# EasyEDA schematic HeaterFlowRegulator_2021-05-24.json
TITLE: Sheet_1; REV: 1.0; Date: 2020-05-02; Sheet: 1/1; Drawn By: Thomas_2213; Company: Your Company
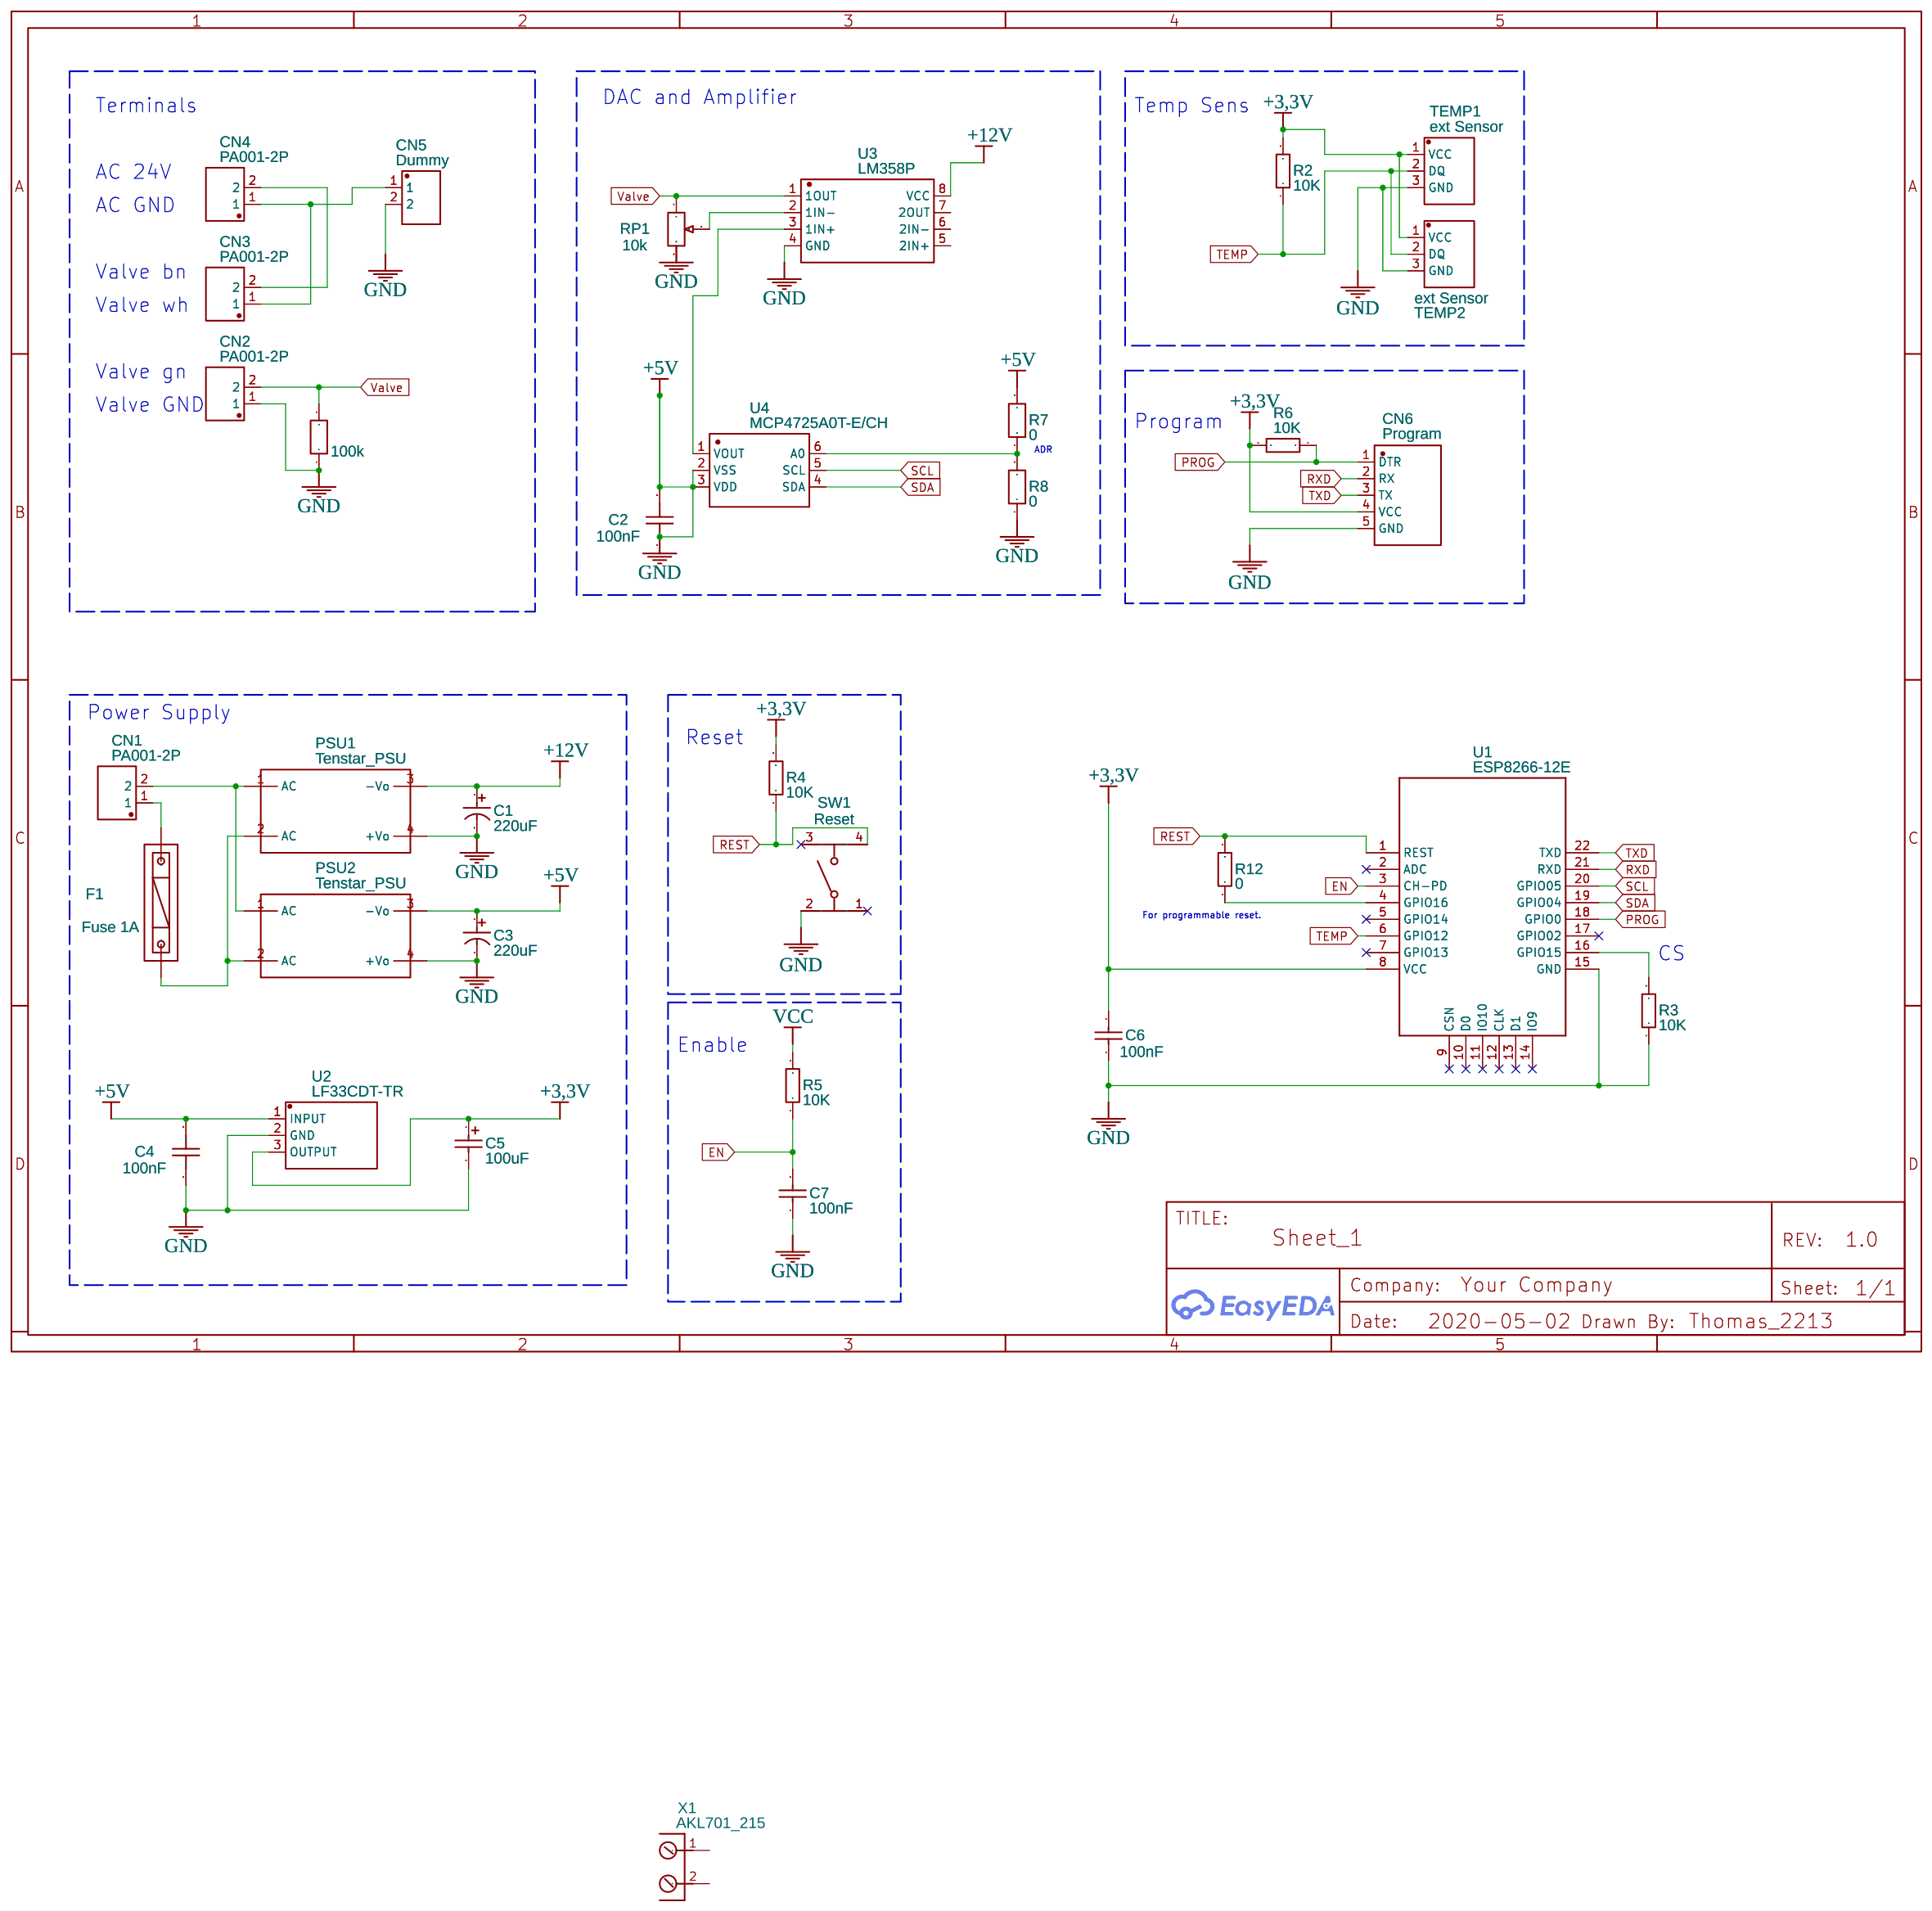
[diagram p0: schematic sheet]

## Parts
C1  220uF  [CAP-TH_BD8.0-P3.50-D1.0-FD]
C2  100nF  [C0603]
C3  220uF  [CAP-TH_BD8.0-P3.50-D1.0-FD]
C4  100nF  [C0603]
C5  100uF  [CAP-SMD_L3.5-W2.8]
C6  100nF  [0603]
C7  100nF  [0603]
CN1  PA001-2P  [CONN-TH_2P-P5.08_PA001-2P]
CN2  PA001-2P  [CONN-TH_2P-P5.08_PA001-2P]
CN3  PA001-2P  [CONN-TH_2P-P5.08_PA001-2P]
CN4  PA001-2P  [CONN-TH_2P-P5.08_PA001-2P]
CN5  Dummy  [CONN-TH_2P-P5.08_PA001-2P]
CN6  Program  [CONN-TH_B5B-XH-AM (LF)(SN)]
F1  Fuse 1A  [FUSE-TH_L22.6-W9.0]
PSU1  Tenstar_PSU  [AC-DC PSU 5V/3W]
PSU2  Tenstar_PSU  [AC-DC PSU 5V/3W]
R1  100k  [R0201]
R2  10K  [0603]
R3  10K  [0603]
R4  10K  [0603]
R5  10K  [0603]
R6  10K  [0603]
R7  0  [R0603]
R8  0  [R0603]
R12  0  [R0603]
RP1  10k  [RES-ADJ-TH_3386P]
SW1  Reset  [KEY-SMD_4P-L6.0-W6.0-P4.50-LS10.0]
TEMP1  ext Sensor  [CONN-TH_3P-P2.50_B3B-XH-AM(LF)(SN)]
TEMP2  ext Sensor  [CONN-TH_3P-P2.50_B3B-XH-AM(LF)(SN)]
U1  ESP8266-12E  [LGA22-2.0-24X16MM]
U2  LF33CDT-TR  [TO-252-2_L6.6-W6.1-P4.57-LS9.9-BR-CW]
U3  LM358P  [DIP-8_L9.4-W6.4-P2.54-LS9.1-BL]
U4  MCP4725A0T-E/CH  [SOT-23-6_L2.9-W1.6-P0.95-LS2.8-BR]
X1  AKL701_215  [AKL701_2_15]

## Library data of the parts
C1 C3 = 220uf/35V: Supplier: LCSC; Manufacturer: ValuePro; Supplier Part: C2063
C2 C4 = CL10B104KC8NNNC: Supplier: LCSC; Manufacturer: SAMSUNG; Supplier Part: C15725; LCSC Assembly: Yes; SMT Type: Extend
C5 = TAJB107K006RNJ: Supplier: LCSC; Manufacturer: AVX; Supplier Part: C16133; JLCPCB Part Class: Basic Part
C6 = CL10B104JB8NNNC: Supplier: LCSC; Manufacturer Part: CL10B104KC8NNNC; Manufacturer: SAMSUNG; Supplier Part: C15725; LCSC Assembly: Yes; SMT Type: Extend
C7 = CL10B104JB8NNNC: Supplier: LCSC; Manufacturer: SAMSUNG; Supplier Part: C24452; LCSC Assembly: Yes; SMT Type: Extend
CN1-CN5 = PA001-2P: Supplier: LCSC; Manufacturer: HIWA; Contributor: LCSC; Supplier Part: C128027; LCSC Assembly: Yes; SMT Type: Extend
CN6 = B5B-XH-AM (LF)(SN): Supplier: LCSC; Supplier Part: C161872; Manufacturer: JST Sales America; Contributor: LCSC
F1 = Fuse transparent seat: Supplier: LCSC; Manufacturer: ReliaPro; image: //image.lceda.cn/szlcsc/C58066.jpg; Supplier Part: C58066; LCSC Assembly: Yes; SMT Type: Extend
PSU1 PSU2 = Tenstar_PSU: Manufacturer Part: Tenstar Robot; Contributor: Steve Shaw; Supplier Part: TSP-05; Supplier: Tenstar Robot
R1 = R_0201_EU: Contributor: LCEDA_Lib; Package Display: No
R2 R3 = TC0310B1002T5E: Supplier: LCSC; Supplier Part: C39050; Manufacturer: UniOhm; Manufacturer Part: TC0325B1002T5E; Contributor: LCSC; LCSC Assembly: Yes; SMT Type: Extend
R4-R6 = TC0310B1002T5E: Supplier: LCSC; Supplier Part: C190321; Manufacturer: Uniroyal Elec; Contributor: LCSC; LCSC Assembly: Yes; SMT Type: Extend
R7 R8 = R_0603_EU: Contributor: LCEDA_Lib
R12 = 0603WAJ0000T5E: Supplier: LCSC; Manufacturer: UniOhm; Supplier Part: C15402
RP1 = R_3386P_EU: Supplier: LCSC; Contributor: LCEDA_Lib; Value(Ω): 10K
SW1 = TL3301TF160QG/D310794: Supplier: LCSC; Supplier Part: C273532; Manufacturer: E-Switch; Contributor: LCSC
TEMP1 TEMP2 = B3B-XH-AM-(LF)(SN): Supplier: LCSC; Supplier Part: C161870; Manufacturer: JST Sales America; Contributor: LCSC
U1 = -: SMD ESP8266 based WiFi module FCC/CE; Supplier Part: 317060015; Supplier: SeeedStudio; Manufacturer Part: ESP8266-12E/ESP-12E; sourceId: x7jTsOM8S
U2 = LF33CDT-TR: Supplier: LCSC; Supplier Part: C222179; Manufacturer: STMicroelectronics; Contributor: LCSC; JLCPCB Part Class: Extended Part
U3 = LM358P: Supplier: LCSC; Manufacturer: TI; image: //image.lceda.cn/szlcsc/C5213.jpg; Supplier Part: C5213
U4 = MCP4725A0T-E/CH: Supplier: LCSC; Manufacturer: MICROCHIP; Contributor: LCSC; Supplier Part: C144198; LCSC Assembly: Yes; SMT Type: Extend
X1 = AKL701_215

## Nets
+5V: C1.2 C2.1 C2.2 C3.1 C3.2 C4.1 C4.2 C5.2 C6.1 C7.1 CN2.1 CN5.2 CN6.5(GND) PSU1.4(+Vo) PSU2.3(-Vo) PSU2.4(+Vo) R1.1 R3.1 R7.2 R8.1 RP1.3 SW1.2 TEMP1.3(GND) TEMP2.3(GND) U1.15(GND) U2.1(INPUT) U2.2(GND) U3.4(GND) U4.2(VSS) U4.3(VDD)
+12V: C1.1 PSU1.3(-Vo) U3.8(VCC)
VCC: R5.2
+3,3V: C5.1 C6.2 CN6.4(VCC) R2.2 R4.2 R6.2 TEMP1.1(VCC) TEMP2.1(VCC) U1.8(VCC) U2.3(OUTPUT)
EN: C7.2 R5.1 U1.3(CH-PD)
PROG: CN6.1(DTR) R6.1 U1.18(GPIO0)
REST: R4.1 R12.2 SW1.4 U1.1(REST)
RXD: CN6.2(RX) U1.21(RXD)
SCL: U1.20(GPIO05) U4.5(SCL)
SDA: U1.19(GPIO04) U4.4(SDA)
TEMP: R2.1 TEMP1.2(DQ) TEMP2.2(DQ) U1.6(GPIO12)
TXD: CN6.3(TX) U1.22(TXD)
Valve: CN2.2 R1.2 RP1.1 U3.1(1OUT)
Net-(CN1-1): CN1.1 F1.2
Net-(CN1-2): CN1.2 PSU1.1(AC) PSU2.1(AC)
Net-(CN3-1): CN3.1 CN4.1 CN5.1
Net-(CN3-2): CN3.2 CN4.2
Net-(F1-1): F1.1 PSU1.2(AC) PSU2.2(AC)
Net-(R3-2): R3.2 U1.16(GPIO15)
Net-(R7-1): R7.1 R8.2 U4.6(A0)
Net-(R12-1): R12.1 U1.4(GPIO16)
Net-(RP1-2): RP1.2 U3.2(1IN-)
Net-(U3-3): U3.3(1IN+) U4.1(VOUT)

Not connected (* = marked no-connect by the designer): SW1 1* 3*; U1 2(ADC)* 5(GPIO14)* 7(GPIO13)* 9(CSN)* 10(D0)* 11(IO10)* 12(CLK)* 13(D1)* 14(IO9)* 17(GPIO02)*; U3 5(2IN+) 6(2IN-) 7(2OUT); X1 1 2

## Notes on the sheet
- Terminals
- DAC and Amplifier
- Temp Sens
- AC 24V
- AC GND
- Valve bn
- Valve wh
- Valve gn
- Valve GND
- Program
- ADR
- Power Supply
- Reset
- For programmable reset.
- CS
- Enable
